# Altium schematic sheet APD9328_ETHERNET.SchDoc: ETHERNET
size A4; Author: NC; Revision: 1.0; SheetNumber: 10; SheetTotal: 14
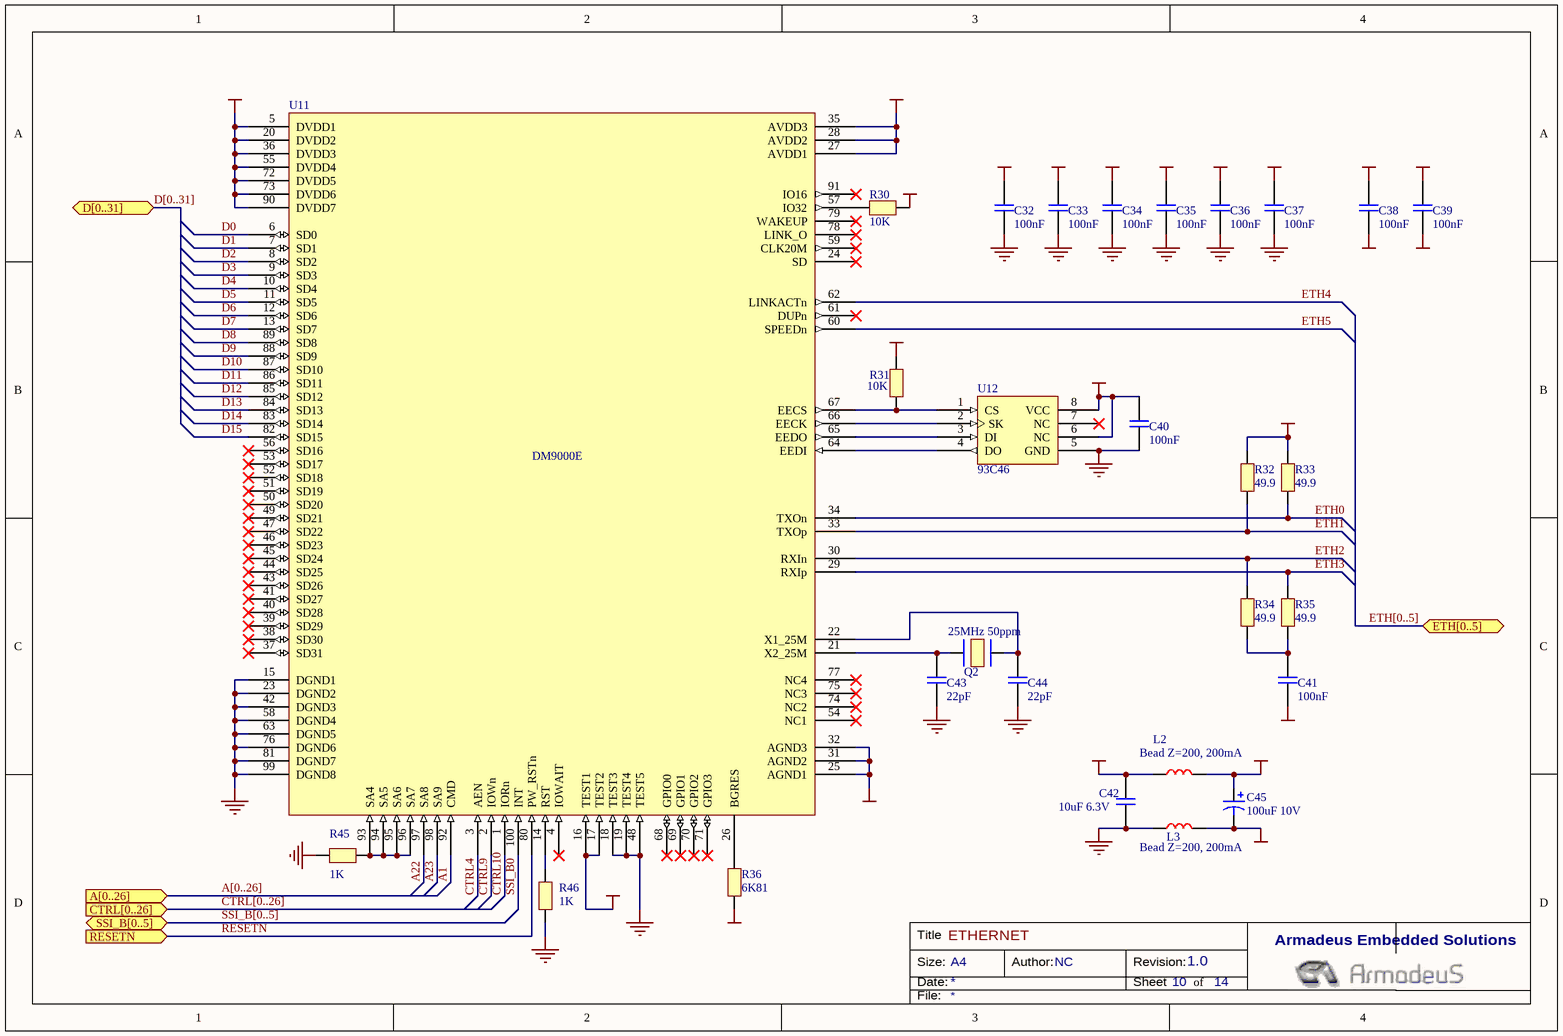
[diagram p0: APD9328_ETHERNET.SchDoc]

## Parts
C32  100nF  [0402]
C33  100nF  [0402]
C34  100nF  [0402]
C35  100nF  [0402]
C36  100nF  [0402]
C37  100nF  [0402]
C38  100nF  [0402]
C39  100nF  [0402]
C40  100nF  [0402]
C41  100nF  [0402]
C42  10uF 6.3V  [0805]
C43  22pF  [0402]
C44  22pF  [0402]
C45  100uF 10V  [D]
L2  Bead Z=200, 200mA  [0603]
L3  Bead Z=200, 200mA  [0603]
Q2  25MHz 50ppm
R30  10K  [0402]
R31  10K  [0402]
R32  49.9  [0402]
R33  49.9  [0402]
R34  49.9  [0402]
R35  49.9  [0402]
R36  6K81  [0402]
R45  1K  [0402]
R46  1K  [0402]
U11  DM9000E  [LQFP100]
U12  93C46  [MSOP8]

## Ports
A[0..26] (in), CTRL[0..26] (in), D[0..31] (bidir), ETH[0..5] (bidir), RESETN (in), SSI_B[0..5] (bidir)

## Nets
+3V3: C32.1 C33.1 C34.1 C35.1 C36.1 C37.1 C40.1 C42.2 L2.1 R30.2 R31.2 U11.5(DVDD1) U11.16(TEST1) U11.17(TEST2) U11.20(DVDD2) U11.36(DVDD3) U11.55(DVDD4) U11.72(DVDD5) U11.73(DVDD6) U11.90(DVDD7) U12.6(NC) U12.8(VCC)
AGND: C38.2 C39.2 C41.1 C45.2 L3.2 R36.1 U11.25(AGND1) U11.31(AGND2) U11.32(AGND3)
AVDD: C38.1 C39.1 C45.1 L2.2 R32.2 R33.2 U11.27(AVDD1) U11.28(AVDD2) U11.35(AVDD3)
GND: C32.2 C33.2 C34.2 C35.2 C36.2 C37.2 C40.2 C42.1 C43.1 C44.1 L3.1 R45.2 R46.1 U11.15(DGND1) U11.18(TEST3) U11.19(TEST4) U11.23(DGND2) U11.42(DGND3) U11.48(TEST5) U11.58(DGND4) U11.63(DGND5) U11.76(DGND6) U11.81(DGND7) U11.99(DGND8) U12.5(GND)
A1: U11.92(CMD)
A22: U11.97(SA8)
A23: U11.98(SA9)
CTRL4: U11.3(AEN)
CTRL9: U11.2(IOWn)
CTRL10: U11.1(IORn)
D0: U11.6(SD0)
D1: U11.7(SD1)
D2: U11.8(SD2)
D3: U11.9(SD3)
D4: U11.10(SD4)
D5: U11.11(SD5)
D6: U11.12(SD6)
D7: U11.13(SD7)
D8: U11.89(SD8)
D9: U11.88(SD9)
D10: U11.87(SD10)
D11: U11.86(SD11)
D12: U11.85(SD12)
D13: U11.84(SD13)
D14: U11.83(SD14)
D15: U11.82(SD15)
ETH0: R33.1 U11.34(TXOn)
ETH1: R32.1 U11.33(TXOp)
ETH2: R34.2 U11.30(RXIn)
ETH3: R35.2 U11.29(RXIp)
ETH4: U11.62(LINKACTn)
ETH5: U11.60(SPEEDn)
RESETN: U11.80(PW_RSTn) ; port RESETN
SSI_B0: U11.100(INT)
NetC41_2: C41.2 R34.1 R35.1
NetC43_2: C43.2 Q2.1 U11.21(X2_25M)
NetC44_2: C44.2 Q2.2 U11.22(X1_25M)
NetR30_1: R30.1 U11.57(IO32)
NetR31_1: R31.1 U11.67(EECS) U12.1(CS)
NetR36_2: R36.2 U11.26(BGRES)
NetR45_1: R45.1 U11.93(SA4) U11.94(SA5) U11.95(SA6) U11.96(SA7)
NetR46_2: R46.2 U11.14(RST)
NetU11_64: U11.64(EEDI) U12.4(DO)
NetU11_65: U11.65(EEDO) U12.3(DI)
NetU11_66: U11.66(EECK) U12.2(SK)

Not connected (* = marked no-connect by the designer): U11 4(IOWAIT)* 24(SD)* 37(SD31)* 38(SD30)* 39(SD29)* 40(SD28)* 41(SD27)* 43(SD26)* 44(SD25)* 45(SD24)* 46(SD23)* 47(SD22)* 49(SD21)* 50(SD20)* 51(SD19)* 52(SD18)* 53(SD17)* 54(NC1)* 56(SD16)* 59(CLK20M)* 61(DUPn)* 68(GPIO0)* 69(GPIO1)* 70(GPIO2)* 71(GPIO3)* 74(NC2)* 75(NC3)* 77(NC4)* 78(LINK_O)* 79(WAKEUP)* 91(IO16)*; U12 7(NC)*

## Buses and harness runs
bus A[0..26] = port A[0..26]
bus CTRL[0..26] = port CTRL[0..26]
bus D[0..31] = port D[0..31]
bus ETH[0..5] = port ETH[0..5]
bus SSI_B[0..5] = port SSI_B[0..5]

## Notes on the sheet
- Title
- Size:
- Date:
- A4
- Author:
- Revision:
- Sheet
- of
- Armadeus Embedded Solutions
- File:

## Library data of the parts
C32 = Cap: Manufacturer: Kemet; Part Number: C0402C104K8RACTU; Assembly Option: E; Distributor: Mouser; Price_100: 0,03; Price_500: 0,02; Price_1000: 0,011
C33-C41 C43 C44 = Cap: Assembly Option: E
C42 = Cap: Cermaic Capacitor; Manufacturer: Kemet; Part Number: C0805C106K9PAC7800; Assembly Option: E; Distributor: Mouser; Price_100: 0,3; Price_500: 0,18; Price_1000: 0,13
C45 = T491D: Solid Tantalum Chip Capacitor, Standard T491 Series - Industrial Grade; Manufacturer: Kemet; Part Number: T491D107K006AS; Assembly Option: E; Published: 17-Jul-2002; LatestRevisionDate: 19-Mar-2004; LatestRevisionNote: Silkscreen dimensions re-sized.; DatasheetDocument: Mar-2001; PackageDocument: Mar-2001; PackageReference: D; Publisher: Altium Limited; Code_JEITA: 7343-31; Distributor: Mouser; Price_100: 0,49; Price_500: 0,21; Price_1000: 0,19
L2 = Self: Bead; Manufacturer: Murata; Part Number: BLM18AG221SN1; Assembly Option: E; Distributor: Mouser; Price_100: 0,05; Price_500: 0,04; Price_1000: 0,028
L3 = Self: Manufacturer: Murata; Part Number: BLM18AG221SN1; Assembly Option: E; Distributor: Mouser; Price_100: 0,05; Price_500: 0,04; Price_1000: 0,028
Q2 = QUARTZ: Manufacturer: ECS; Part Number: ECS-250-18-5P; Assembly Option: E; Distributor: Mouser; Price_100: 0,46; Price_500: 0,41; Price_1000: 0,36
R30-R36 R45 R46 = Res: Assembly Option: E
U11 = DM9000: Ethernet Single Chip; Manufacturer: Davicom; Assembly Option: E; Part Number: DM9000E; Distributor: Dacomwest; Price_100: 6,63; Price_500: 5,48; Price_1000: 4,5
U12 = 93C46: Serial Microwire EEPROM; Manufacturer: Microchip; Part Number: 93LC46B-I/MS; Assembly Option: E; Distributor: Mouser; Price_100: 0,38; Price_500: 0,3; Price_1000: 0,26